# EAGLE design list_1 (EAGLE 6.3)
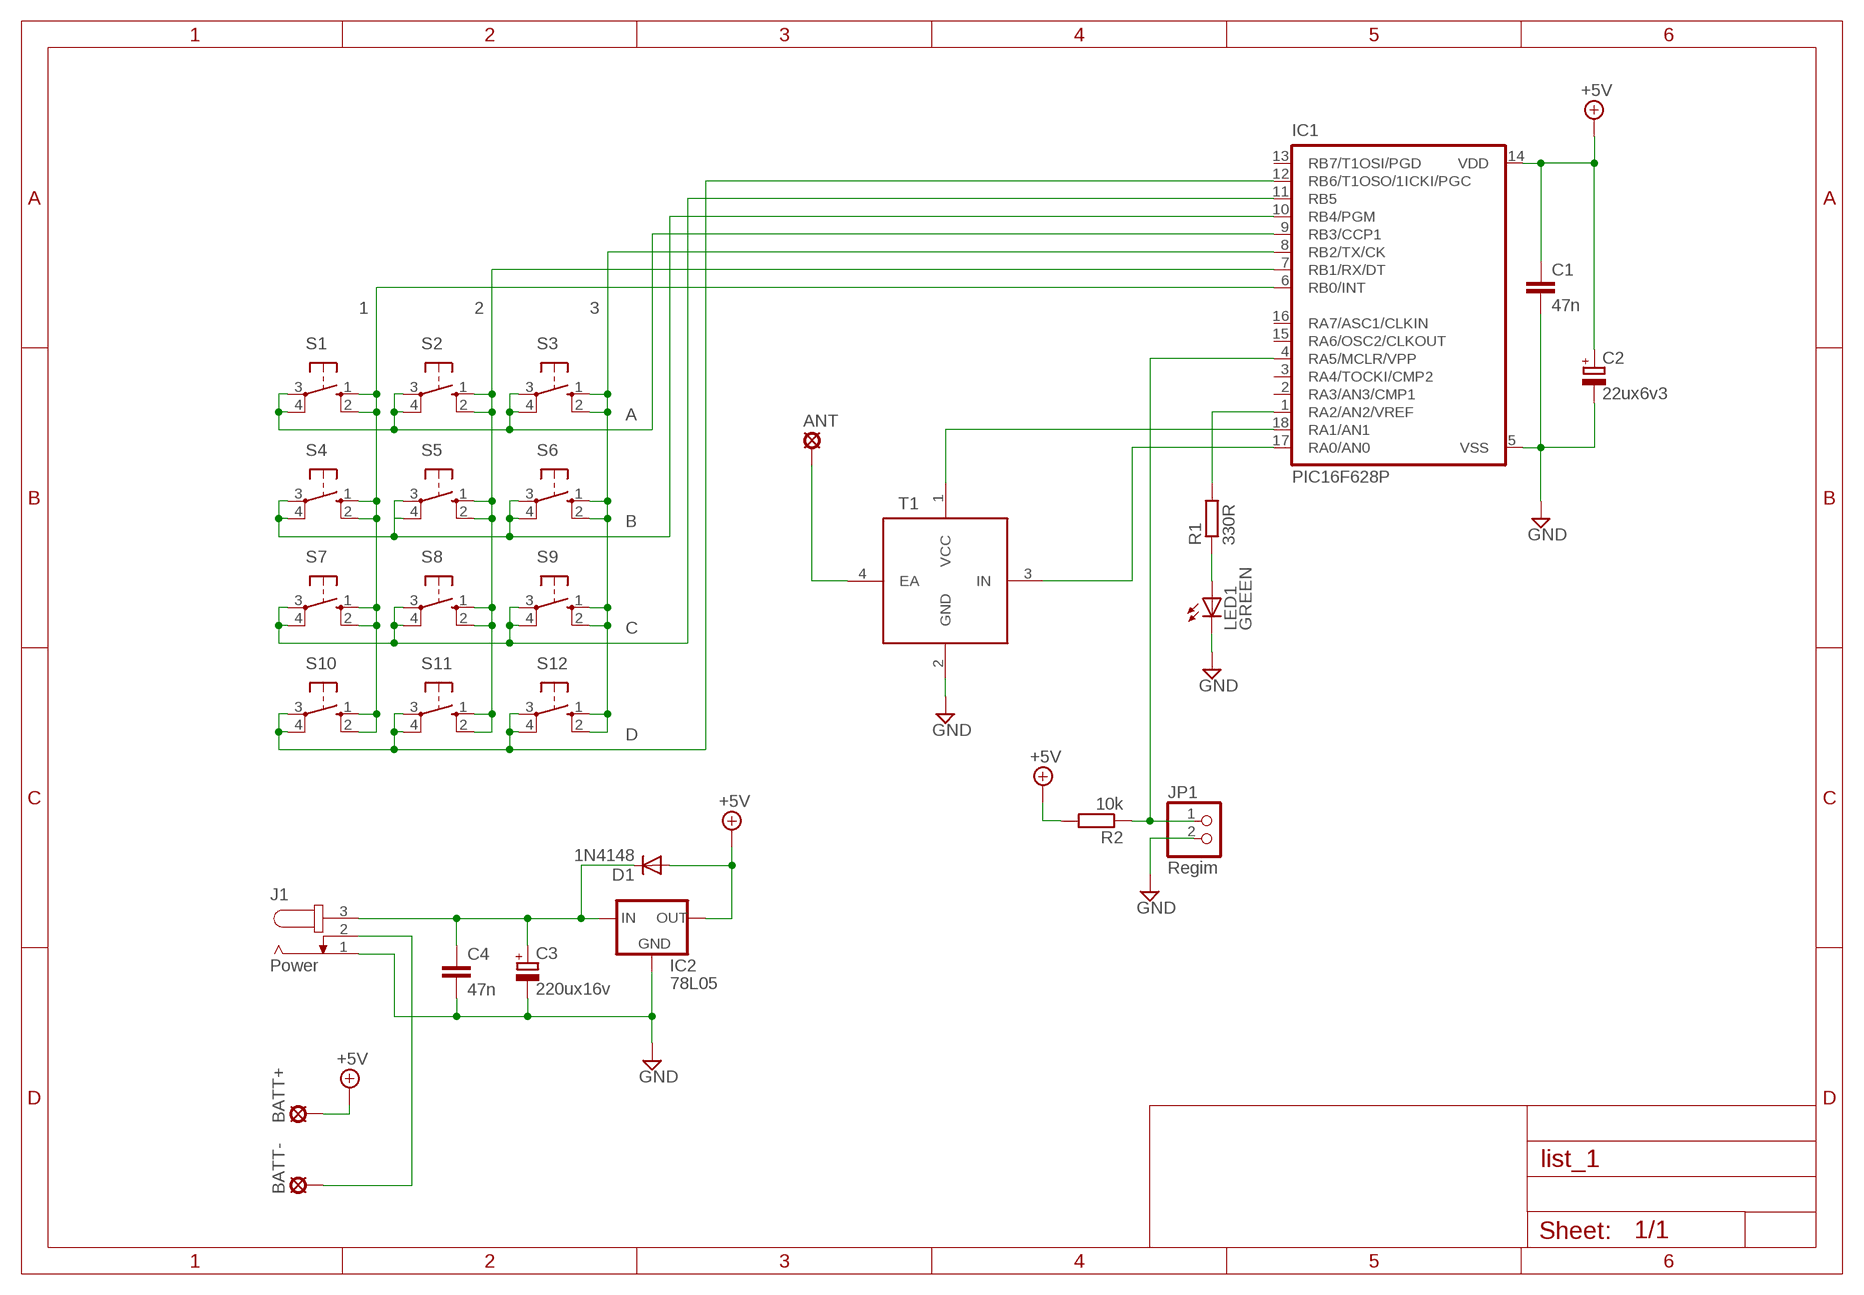
[diagram p0: schematic, sheet 1]

## Parts
ANT  SE11  [SE11]
BATT+  SE11  [SE11]
BATT-  SE11  [SE11]
C1  47n  C-EU050-025X075  [C050-025X075]
C2  22ux6v3  CPOL-EUE2.5-5  [E2,5-5]
C3  220ux16v  CPOL-EUE2.5-5  [E2,5-5]
C4  47n  C-EU050-025X075  [C050-025X075]
D1  1N4148  1N4148DO35-7  [DO35-7]
IC1  PIC16F628P  [DIL18]
IC2  78L05  78LXX  [78LXX]
J1  Power  JACK-PLUG0  [SPC4077]
JP1  Regim  PINHD-1X2  [1X02]
LED1  GREEN  LED3MM  [LED3MM]
R1  330R  R-EU_0207/10  [0207/10]
R2  10k  R-EU_0207/10  [0207/10]
S1  40-XX  [B3F-40XX]
S2  40-XX  [B3F-40XX]
S3  40-XX  [B3F-40XX]
S4  40-XX  [B3F-40XX]
S5  40-XX  [B3F-40XX]
S6  40-XX  [B3F-40XX]
S7  40-XX  [B3F-40XX]
S8  40-XX  [B3F-40XX]
S9  40-XX  [B3F-40XX]
S10  40-XX  [B3F-40XX]
S11  40-XX  [B3F-40XX]
S12  40-XX  [B3F-40XX]
T1  RT4  [RT4]

## Nets
+5V: BATT+.MP C1.1 C2.+ D1.A IC1.14(VDD) IC2.OUT R2.2
GND: C1.2 C2.- C3.- C4.2 IC1.5(VSS) IC2.GND J1.1 JP1.2 LED1.K(C) T1.2(GND)
N$1: LED1.A R1.1
N$2: IC1.9(RB3/CCP1) S1.3(P) S1.4(P1) S2.3(P) S2.4(P1) S3.3(P) S3.4(P1)
N$3: IC1.10(RB4/PGM) S4.3(P) S4.4(P1) S5.3(P) S5.4(P1) S6.3(P) S6.4(P1)
N$4: IC1.4(RA5/MCLR/VPP) JP1.1 R2.1
N$5: IC1.12(RB6/T1OSO/1ICKI/PGC) S10.3(P) S10.4(P1) S11.3(P) S11.4(P1) S12.3(P) S12.4(P1)
N$6: IC1.6(RB0/INT) S1.1(S) S1.2(S1) S4.1(S) S4.2(S1) S7.1(S) S7.2(S1) S10.1(S) S10.2(S1)
N$7: IC1.7(RB1/RX/DT) S2.1(S) S2.2(S1) S5.1(S) S5.2(S1) S8.1(S) S8.2(S1) S11.1(S) S11.2(S1)
N$8: IC1.8(RB2/TX/CK) S3.1(S) S3.2(S1) S6.1(S) S6.2(S1) S9.1(S) S9.2(S1) S12.1(S) S12.2(S1)
N$9: IC1.11(RB5) S7.3(P) S7.4(P1) S8.3(P) S8.4(P1) S9.3(P) S9.4(P1)
N$10: IC1.1(RA2/AN2/VREF) R1.2
N$11: C3.+ C4.1 D1.C IC2.IN J1.3
N$12: IC1.17(RA0/AN0) T1.3(IN)
N$13: BATT-.MP J1.2
N$14: IC1.18(RA1/AN1) T1.1(VCC)
N$15: ANT.MP T1.4(EA)
Unconnected: IC1.2(RA3/AN3/CMP1) IC1.3(RA4/TOCKI/CMP2) IC1.13(RB7/T1OSI/PGD) IC1.15(RA6/OSC2/CLKOUT) IC1.16(RA7/ASC1/CLKIN)

## Notes on the sheet
- 1 | 2 | 3
- A
- B
- C
- D

## Library data of the parts
ANT BATT+ BATT- = solpad:SE11: SOLDER PAD RTM, drill 1,1mm, distributor Buerklin, 07F810
C1 C4 = rcl:C-EU: CAPACITOR, European symbol
C2 C3 = rcl:CPOL-EU: POLARIZED CAPACITOR, European symbol
D1 = diode:1N4148: DIODE high speed (Philips)
IC1 = microchip-6:PIC16*F62: FLASH-Based 8-Bit CMOS Microcontroller Source: http://ww1.microchip.com/downloads/en/DeviceDoc/40300C.pdf
IC2 = v-reg:78LXX: VOLTAGE REGULATOR
J1 = con-jack:JACK-PLUG: DC POWER JACK Power Jack, DC, Right Angle, Through Hole, Rated 5A at 16VDC, PC Terminals Distributor: Farnell (www.Farnell.de) Drawing: 84N1161.pdf / 84N1162.pdf Manufacturer: SPC Technology (www.spctechnology.com) Type: SPC4077 / SPC 4078
JP1 = pinhead:PINHD-1X2: PIN HEADER
LED1 = led:LED: LED OSRAM: - CHIPLED LG R971, LG N971, LY N971, LG Q971, LY Q971, LO R971, LY R971 LH N974, LH R974 LS Q976, LO Q976, LY Q976 LO Q996 - Hyper CHIPLED LW Q18S LB Q993, LB Q99A, LB R99A - SideLED LS A670, LO A670, LY A670, LG A670, LP A670 LB A673, LV A673, LT A673, LW A673 LH A674 LY A675 LS A676, LA A676, LO A676, LY A676, LW A676 LS A679, LY A679, LG A679 - Hyper Micro SIDELED® LS Y876, LA Y876, LO Y876, LY Y876 LT Y87S - SmartLED LW L88C, LW L88S LB L89C, LB L89S, LG L890 LS L89K, LO L89K, LY L89K LS L896, LA L896, LO L896, LY L896 - TOPLED LS T670, LO T670, LY T670, LG T670, LP T670 LSG T670, LSP T670, LSY T670, LOP T670, LYG T670 LG T671, LOG T671, LSG T671 LB T673, LV T673, LT T673, LW T673 LH T674 LS T676, LA T676, LO T676, LY T676, LB T676, LH T676, LSB T676, LW T676 LB T67C, LV T67C, LT T67C, LS T67K, LO T67K, LY T67K, LW E67C LS E67B, LA E67B, LO E67B, LY E67B, LB E67C, LV E67C, LT E67C LW T67C LS T679, LY T679, LG T679 LS T770, LO T770, LY T770, LG T770, LP T770 LB T773, LV T773, LT T773, LW T773 LH T774 LS E675, LA E675, LY E675, LS T675 LS T776, LA T776, LO T776, LY T776, LB T776 LHGB T686 LT T68C, LB T68C - Hyper Mini TOPLED® LB M676 - Mini TOPLED Santana® LG M470 LS M47K, LO M47K, LY M47K Source: http://www.osram.convergy.de LUXEON: - LUMILED® LXK2-PW12-R00, LXK2-PW12-S00, LXK2-PW14-U00, LXK2-PW14-V00 LXK2-PM12-R00, LXK2-PM12-S00, LXK2-PM14-U00 LXK2-PE12-Q00, LXK2-PE12-R00, LXK2-PE12-S00, LXK2-PE14-T00, LXK2-PE14-U00 LXK2-PB12-K00, LXK2-PB12-L00, LXK2-PB12-M00, LXK2-PB14-N00, LXK2-PB14-P00, LXK2-PB14-Q00 LXK2-PR12-L00, LXK2-PR12-M00, LXK2-PR14-Q00, LXK2-PR14-R00 LXK2-PD12-Q00, LXK2-PD12-R00, LXK2-PD12-S00 LXK2-PH12-R00, LXK2-PH12-S00 LXK2-PL12-P00, LXK2-PL12-Q00, LXK2-PL12-R00 Source: www.luxeon.com KINGBRIGHT: KA-3528ASYC Source: www.kingbright.com
R1 R2 = rcl:R-EU_: RESISTOR, European symbol
S1-S12 = switch-omron:40-XX: OMRON SWITCH
T1 = rf_moduls:RT4

## Board
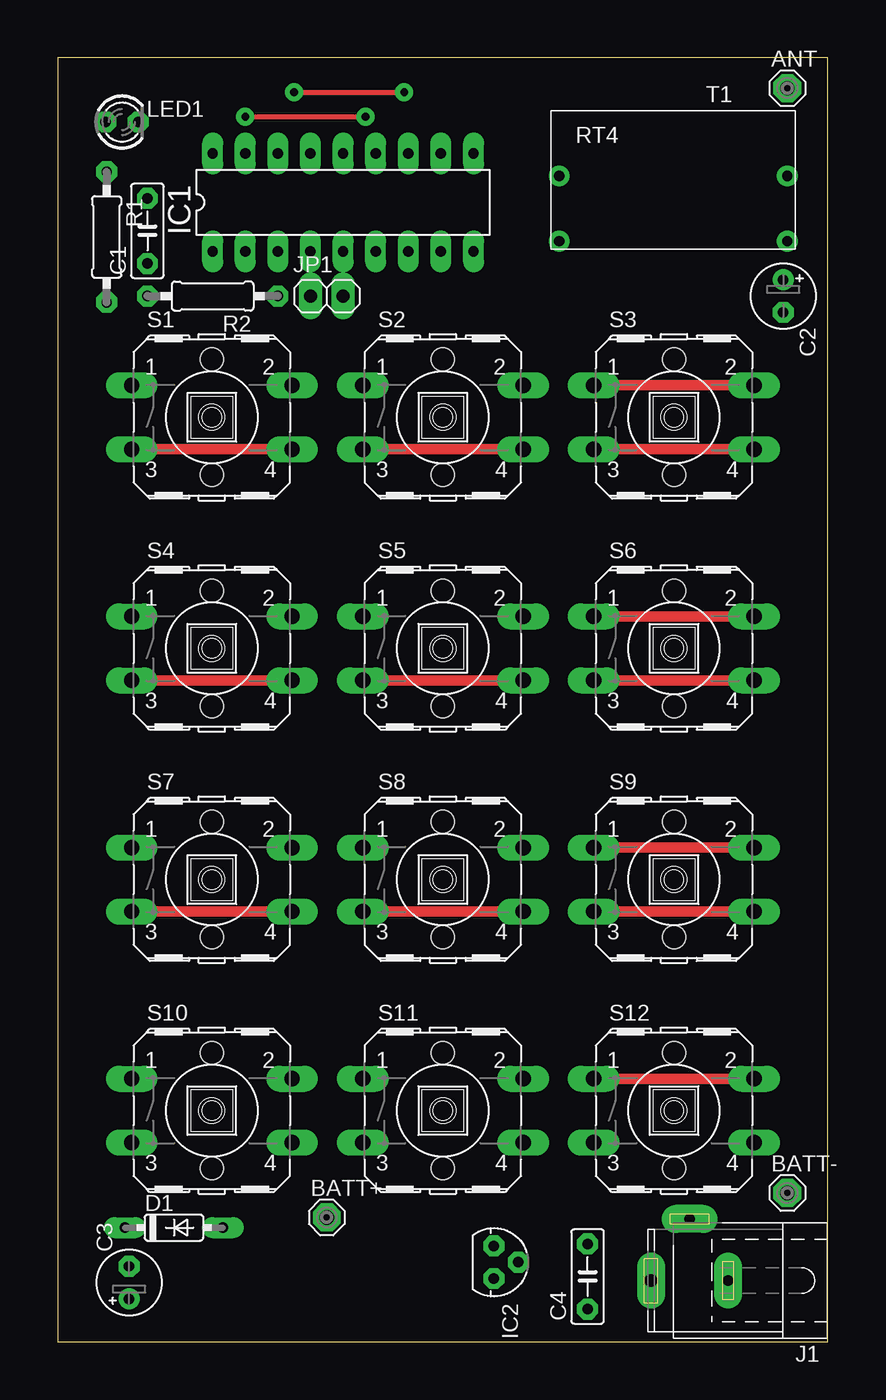
[diagram p1: board, top side]
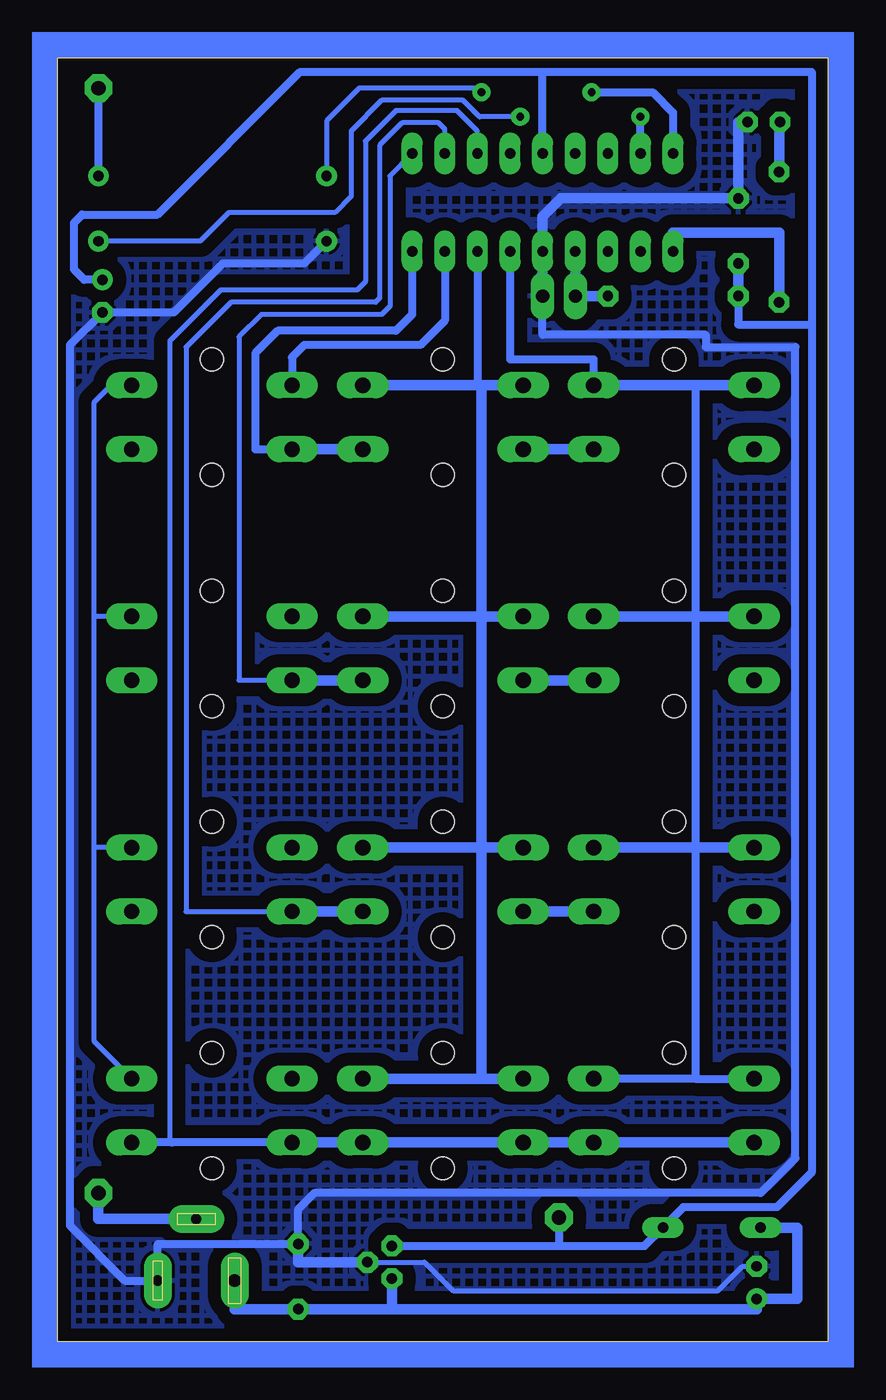
[diagram p2: board, bottom side, seen from below]

Size 60 x 100 mm. Coordinates in mm from the lower left corner, seen from the top.
Outline: 0,0 60,0 60,100 0,100 0,0
Copper layers (1*16): Top 0.035mm / dielectric 1.5mm / Bottom 0.035mm
Design rules "default *": minimum track width 10mil, minimum drill 24mil, track to track 8mil, track to pad 8mil, pad to pad 8mil, via to via 8mil, smd to smd 8mil, copper to edge 40mil, drill to drill 8mil, minimum pad ring 16mil, minimum via ring 16mil, stop-mask expansion 4mil, vias tented up to drill 0mil, thermal gap 10mil

### Footprints (pad centres in the part's own frame; a part is rotated, then mirrored left to right if it is on the bottom)
SE11 = drill 1.118 pad 2.159 octagon: MP 0,0
C050-025X075 = drill 0.813 octagon: 1 -2.54,0; 2 2.54,0
E2,5-5 = drill 0.813 pad 1.6: + -1.27,0 | drill 0.813 pad 1.6 octagon: - 1.27,0
DO35-7 = drill 0.813 long: A 3.81,0; C -3.81,0
DIL18 = drill 0.813 long: 1 -10.16,-3.81; 2 -7.62,-3.81; 3 -5.08,-3.81; 4 -2.54,-3.81; 5 0,-3.81; 6 2.54,-3.81; 7 5.08,-3.81; 8 7.62,-3.81; 9 10.16,-3.81; 10 10.16,3.81; 11 7.62,3.81; 12 5.08,3.81; 13 2.54,3.81; 14 0,3.81; 15 -2.54,3.81; 16 -5.08,3.81; 17 -7.62,3.81; 18 -10.16,3.81
78LXX = drill 0.813 octagon: GND 0,1.905; IN 1.27,0; OUT -1.27,0
SPC4077 = drill 0.8 pad 2.184 long: 1 -3,0; 2 0,-4.8 | drill 1 pad 2.184 long: 3 3,0
1X02 = drill 1.016 long: 1 -1.27,0; 2 1.27,0
LED3MM = drill 0.813 octagon: A -1.27,0; K 1.27,0
0207/10 = drill 0.813 octagon: 1 -5.08,0; 2 5.08,0
B3F-40XX = drill 1.194 long: 1 -6.248,2.489; 2 6.248,2.489; 3 -6.248,-2.489; 4 6.248,-2.489 | hole 1.803: 0,-4.496; 0,4.496
RT4 = drill 0.8: 1 -8.89,0; 2 -8.89,-5.08; 3 8.89,-5.08; 4 8.89,0

### Placement (x,y rotation side)
ANT  56.83,97.63 0 top
BATT+  20.95,9.68 0 top
BATT-  56.83,11.59 0 top
C1  6.99,86.52 90 top
C2  56.52,81.44 270 top
C3  5.56,4.6 90 top
C4  41.27,5.08 90 top
D1  9.05,8.89 0 top
IC1  22.23,88.74 0 top
IC2  33.97,6.19 270 top
J1  49.21,4.76 180 top
JP1  20.95,81.44 0 top
LED1  5,95 0 top
R1  3.81,86.04 270 top
R2  12.06,81.44 180 top
S1  12,72 0 top
S2  30,72 0 top
S3  48,72 0 top
S4  12,54 0 top
S5  30,54 0 top
S6  48,54 0 top
S7  12,36 0 top
S8  30,36 0 top
S9  48,36 0 top
S10  12,18 0 top
S11  30,18 0 top
S12  48,18 0 top
T1  47.94,90.81 0 top

### Tracks (layer width: path | path; a pad name or v marks a point on that pad's centre or on a via)
+5V
  Bottom 0.61: IC1.14 22.23,98.74 | 22.23,98.74 22.23,98.9 1.27,98.9 1.27,79.22 | IC2.OUT 20.95,7.46 | 20.95,7.46 14.29,7.46 D1.A 11.27,10.48 3.97,10.48 1.27,13.18 1.27,79.22 | R2.2 6.99,79.22 1.27,79.22 | C2.+ 57.94,82.71 58.74,83.5 58.74,87.15 58.1,87.79 52.23,87.79 41.12,98.9 22.38,98.9 22.23,98.74 | BATT+.MP 20.95,7.46
  Bottom 0.813: C1.1 R2.2
GND
  Bottom 0.406: IC2.GND 31.43,6.19 29.21,3.97 8.57,3.97 6.67,5.87 C3.-
  Bottom 0.61: JP1.2 22.23,78.42 9.53,78.42 9.53,77.47 2.54,77.47 2.54,14.29 5.24,11.59 40.01,11.59 41.27,10.32 C4.2 52.21,7.62 J1.1 54.77,4.76 59.05,9.05 59.05,77.63 C2.- 50.96,80.17 47.15,83.98 40.8,83.98 T1.2
  Bottom 0.813: IC2.GND 41.27,6.19 C4.2 | JP1.2 IC1.5 22.23,87.63 20.8,89.06 C1.2 6.99,95 LED1.K
  pour Bottom (isolate 1.016, hatched): 0.16,99.85 59.85,99.85 59.85,0.16 0.16,0.16
N$1
  Bottom 0.813: LED1.A 3.81,95 R1.1
N$2
  Top 0.813: S1.3 S1.4 | S2.3 S2.4 | S3.4 S3.3
  Bottom 0.61: IC1.9 32.38,80.01 33.66,78.74 42.86,78.74 44.61,76.99 44.61,69.51 S3.3 | 54.27,69.53 S3.4
  Bottom 0.813: S2.3 S1.4 | S2.4 S3.3
N$3
  Top 0.813: S5.3 S5.4 | S4.3 S4.4 | S6.4 S6.3
  Bottom 0.406: IC1.10 34.13,90.81 34.13,80.64 34.77,80.01 44.13,80.01 45.88,78.26 45.88,51.51 S6.3
  Bottom 0.813: S5.4 S6.3 | S4.4 S5.3
N$4
  Bottom 0.813: IC1.4 JP1.1 R2.1
N$5
  Bottom 0.406: IC1.12 27.3,94.3 28.89,95.89 33.66,95.89 36.04,93.5 36.04,82.55 36.67,81.92 47.31,81.92 51.28,77.95 51.28,15.67 51.12,15.51
  Bottom 0.61: S12.3 51.12,15.51 S12.4
  Bottom 0.813: S10.3 S10.4 S11.3 S11.4 S12.3
N$6
  Bottom 0.61: IC1.6 24.77,76.52 18.26,76.52 S1.2 10.32,74.49 10.32,56.52 10.32,38.58 | 10.32,38.49 10.32,20.48 | 10.32,20.48 5.75,20.48 S10.1 | 10.32,20.48 18.25,20.48 S10.2
  Bottom 0.813: S1.1 S1.2 | S4.2 10.32,56.49 | S4.1 10.32,56.49 | 10.32,56.49 10.32,56.52 | S7.2 10.32,38.49 | 10.32,38.49 10.32,38.58 | 10.32,38.49 S7.1
N$7
  Bottom 0.406: 29.53,20.49 26.99,20.49
  Bottom 0.61: IC1.7 27.3,74.65 27.15,74.49
  Bottom 0.813: S2.1 26.99,74.49 | 26.99,74.49 27.15,74.49 S2.2 29.53,74.49 | 29.53,20.49 29.53,20.48 | S11.1 29.53,20.49 | 29.53,20.49 S11.2 | S5.2 26.99,56.49 | S8.2 26.99,38.49 | 26.99,20.49 26.99,20.8 26.99,38.49 | S8.1 26.99,38.49 | 26.99,38.49 26.99,56.49 | S5.1 26.99,56.49 | 26.99,56.49 26.99,74.49
N$8
  Top 0.813: S3.1 S3.2 | S9.1 S9.2 | S12.1 S12.2 | S6.1 S6.2
  Bottom 0.406: S12.2 57.15,23.39 57.15,38.58 | 57.15,38.58 57.15,56.52 | 57.15,56.52 57.15,73.18 55.84,74.49 S3.2 | S9.2 57.06,38.49 57.15,38.58 | S6.2 57.12,56.49 57.15,56.52
  Bottom 0.61: IC1.8 29.84,79.53 31.75,77.63 40.8,77.63 41.75,76.68 S3.1
N$9
  Top 0.813: S7.3 S7.4 | S8.3 S8.4 | S9.3 S9.4
  Bottom 0.406: IC1.11 29.84,94.46 30.32,94.93 33.18,94.93 34.92,93.19 34.92,81.28 35.24,80.96 46.51,80.96 50.01,77.47 50.01,33.51 S9.3
  Bottom 0.813: S7.4 S8.3 | S8.4 S9.3
N$10
  Bottom 0.813: IC1.1 12.06,86.36 3.81,86.36 R1.2
N$11
  Bottom 0.813: J1.3 46.21,2.54 C4.1 33.97,2.54 | 33.97,2.54 5.56,2.54 C3.+ 2.38,3.33 2.38,8.89 D1.C | IC2.IN 33.97,2.54
N$12  (via drill 0.6)
  Top 0.406: v14.61,95.41 v23.97,95.41
  Bottom 0.406: v23.97,95.41 27.15,95.41 28.42,96.68 34.77,96.68 37.15,94.3 37.15,89.22 38.42,87.95 46.67,87.95 48.9,85.72 T1.3
  Bottom 0.61: IC1.17 v14.61,95.41
N$13
  Bottom 0.813: J1.2 56.83,9.56 BATT-.MP
N$14  (via drill 0.6)
  Top 0.406: v18.41,97.31 v26.99,97.31
  Bottom 0.406: v26.99,97.31 26.99,97.63 36.51,97.63 39.05,95.09 T1.1
  Bottom 0.61: v18.41,97.31 13.65,97.31 12.06,95.73 IC1.18
N$15
  Bottom 0.61: ANT.MP T1.4
(copper drawn outside any net)
  shapes: Bottom area x4